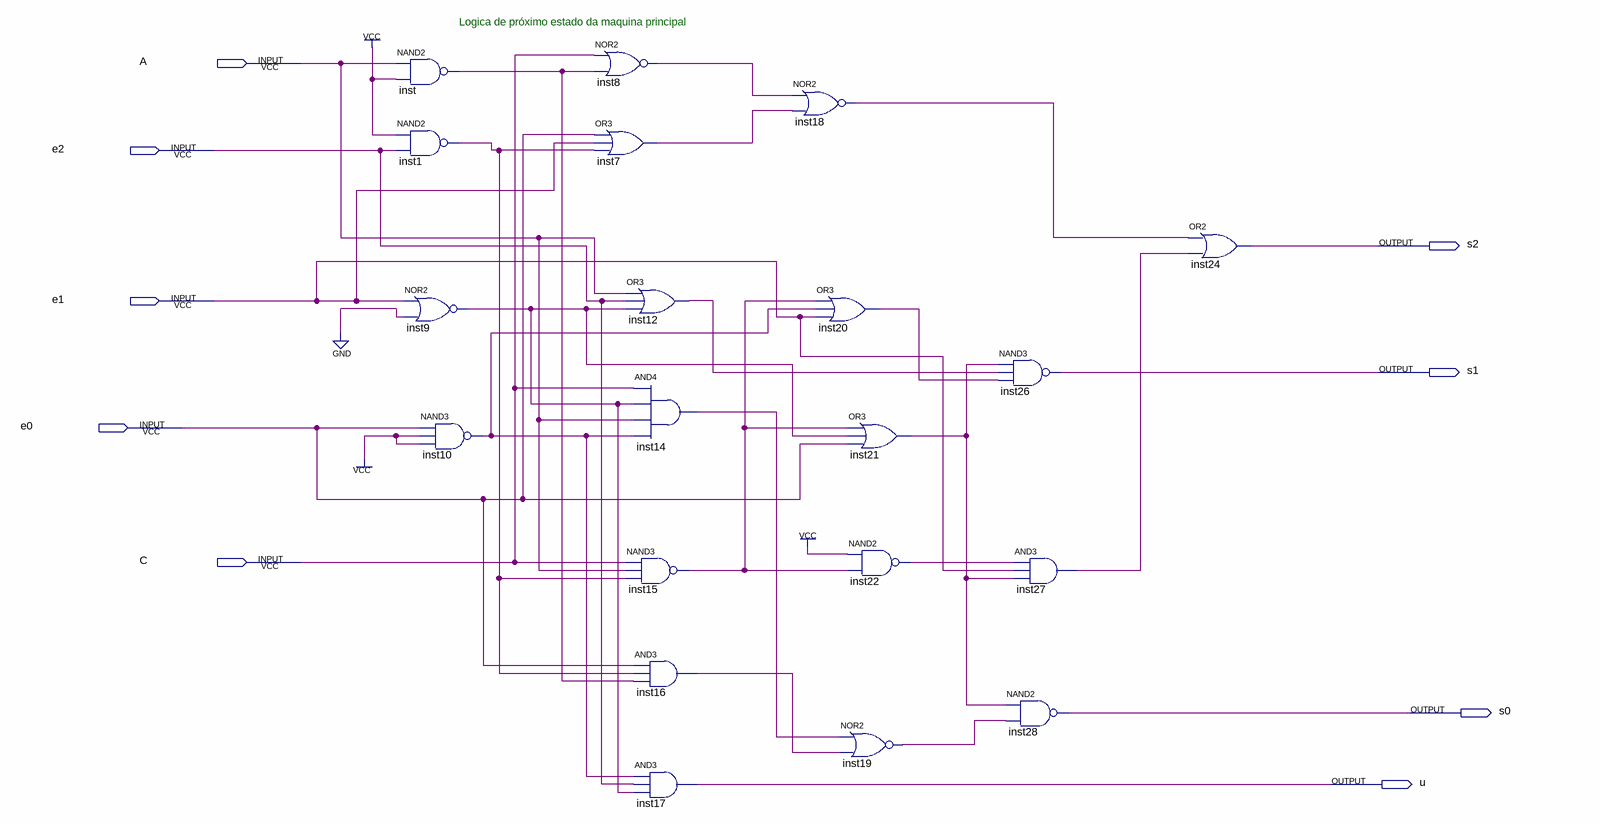
[diagram p0: schematic sheet]
// Quartus schematic Principal.bdf as structural Verilog: 20 symbols, 9 pins
module Principal (
  input  A,
  input  e2,
  input  e1,
  input  e0,
  input  C,
  output s2,
  output s1,
  output s0,
  output u
);

  wire inst1_out, inst7_out, inst8_out, inst9_out, inst10_out, inst12_out, inst14_out, inst15_out,
       inst16_out, inst18_out, inst19_out, inst20_out, inst21_out, inst22_out, inst27_out, inst_out;

  nand inst (inst_out, A, 1'b1);
  nand inst1 (inst1_out, 1'b1, e2);
  nor inst9 (inst9_out, e1, 1'b0);
  nand inst10 (inst10_out, e0, 1'b1, 1'b1);
  nor inst8 (inst8_out, C, inst_out);
  or inst7 (inst7_out, e0, e1, inst1_out);
  or inst12 (inst12_out, A, e2, inst9_out);
  and inst14 (inst14_out, C, inst9_out, A, inst10_out);
  nand inst15 (inst15_out, C, A, inst1_out);
  and inst16 (inst16_out, e0, inst1_out, inst_out);
  and inst17 (u, inst10_out, e2, inst9_out);
  nor inst18 (inst18_out, inst8_out, inst7_out);
  or inst20 (inst20_out, inst15_out, inst10_out, e1);
  or inst21 (inst21_out, inst15_out, inst9_out, e0);
  nand inst22 (inst22_out, 1'b1, inst15_out);
  nor inst19 (inst19_out, inst14_out, inst16_out);
  nand inst26 (s1, inst21_out, inst12_out, inst20_out);
  and inst27 (inst27_out, inst22_out, e1, inst21_out);
  nand inst28 (s0, inst21_out, inst19_out);
  or inst24 (s2, inst18_out, inst27_out);

  // Notes on the sheet:
  //   Logica de próximo estado da maquina principal 
endmodule
